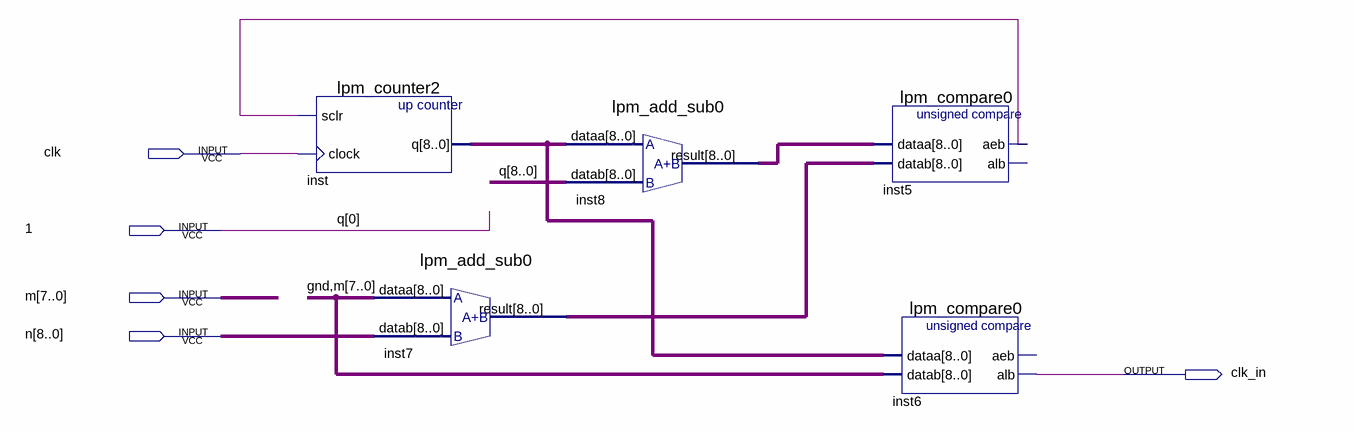
[diagram p0: schematic sheet]
// Quartus schematic dop_block.bdf as structural Verilog: 5 symbols, 5 pins
module dop_block (
  input  clk,
  input  \1 ,
  input  [7:0] m,
  input  [8:0] n,
  output clk_in
);

  wire gnd, inst5_aeb;
  wire [8:0] inst7_result, inst8_result, inst_q;
  wire [8:1] q;

  lpm_counter2 inst (.sclr(inst5_aeb), .clock(clk), .q(inst_q));
  lpm_add_sub0 inst7 (.dataa({gnd, m}), .datab(n), .result(inst7_result));
  lpm_add_sub0 inst8 (.dataa(inst_q), .datab({q, \1 }), .result(inst8_result));
  lpm_compare0 inst5 (.dataa(inst8_result), .datab(inst7_result), .aeb(inst5_aeb));  // open: alb
  lpm_compare0 inst6 (.dataa(inst_q), .datab({gnd, m}), .alb(clk_in));  // open: aeb

  // Other names for the same wires on the sheet: q[0] = \1 
endmodule
